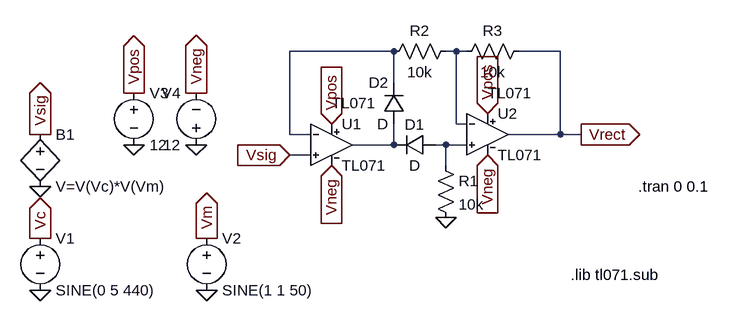
[diagram p0: schematic envfollow.asc]
envfollow.asc, the LTspice schematic file:
Version 4
SHEET 1 880 680
WIRE 304 192 144 192
WIRE 400 192 384 192
WIRE 416 192 400 192
WIRE 560 192 496 192
WIRE 304 240 304 192
WIRE 400 304 400 192
WIRE 416 304 400 304
WIRE 144 320 144 192
WIRE 176 320 144 320
WIRE 560 320 560 192
WIRE 560 320 480 320
WIRE 592 320 560 320
WIRE 304 336 304 304
WIRE 304 336 240 336
WIRE 384 336 368 336
WIRE 416 336 384 336
WIRE 176 352 144 352
WIRE 384 368 384 336
FLAG -240 560 0
FLAG 16 560 0
FLAG -240 400 0
FLAG -240 480 Vc
IOPIN -240 480 Out
FLAG 16 480 Vm
IOPIN 16 480 Out
FLAG -240 320 Vsig
IOPIN -240 320 Out
FLAG -96 336 0
FLAG 0 336 0
FLAG -96 256 Vpos
IOPIN -96 256 Out
FLAG 0 256 Vneg
IOPIN 0 256 Out
FLAG 208 304 Vpos
IOPIN 208 304 In
FLAG 208 368 Vneg
IOPIN 208 368 In
FLAG 448 288 Vpos
IOPIN 448 288 In
FLAG 448 352 Vneg
IOPIN 448 352 In
FLAG 384 448 0
FLAG 144 352 Vsig
IOPIN 144 352 In
FLAG 592 320 Vrect
IOPIN 592 320 Out
SYMBOL Voltage -240 464 R0
SYMATTR InstName V1
SYMATTR Value SINE(0 5 440)
SYMBOL Voltage 16 464 R0
SYMATTR InstName V2
SYMATTR Value SINE(1 1 50)
SYMBOL bv -240 304 R0
SYMATTR InstName B1
SYMATTR Value V=V(Vc)*V(Vm)
SYMBOL TL071 208 272 R0
SYMATTR InstName U1
SYMBOL Voltage -96 240 R0
SYMATTR InstName V3
SYMATTR Value 12
SYMBOL Voltage 0 352 R180
WINDOW 0 24 96 Left 2
WINDOW 3 24 16 Left 2
SYMATTR InstName V4
SYMATTR Value 12
SYMBOL TL071 448 256 R0
SYMATTR InstName U2
SYMBOL Diode 368 320 R90
WINDOW 0 0 32 VBottom 2
WINDOW 3 32 32 VTop 2
SYMATTR InstName D1
SYMBOL Diode 320 304 R180
WINDOW 0 24 64 Left 2
WINDOW 3 24 0 Left 2
SYMATTR InstName D2
SYMBOL Res 368 352 R0
SYMATTR InstName R1
SYMATTR Value 10k
SYMBOL Res 400 176 R90
WINDOW 0 0 56 VBottom 2
WINDOW 3 32 56 VTop 2
SYMATTR InstName R2
SYMATTR Value 10k
SYMBOL Res 512 176 R90
WINDOW 0 0 56 VBottom 2
WINDOW 3 32 56 VTop 2
SYMATTR InstName R3
SYMATTR Value 10k
TEXT 680 400 Left 2 !.tran 0 0.1
TEXT 576 536 Left 2 !.lib tl071.sub

The netlist it stands for:
* envfollow.asc
V1 Vc 0 SINE(0 5 440)
V2 Vm 0 SINE(1 1 50)
B1 Vsig 0 V=V(Vc)*V(Vm)
XU1 Vsig N001 Vpos Vneg N003 TL071 TL071  ; pins In+ In- V+ V- OUT
V3 Vpos 0 12
V4 0 Vneg 12
XU2 N004 N002 Vpos Vneg Vrect TL071 TL071  ; pins In+ In- V+ V- OUT
D1 N004 N003 D
D2 N003 N001 D
R1 N004 0 10k
R2 N002 N001 10k
R3 Vrect N002 10k
.model D D
.lib standard.dio
.tran 0 0.1
.lib tl071.sub
.lib TL071.sub
.backanno
.end